# Altium schematic sheet XTIDA-010086_Control_Card_exTrip.SchDoc
size A3; SheetNumber: 1; SheetTotal: 1
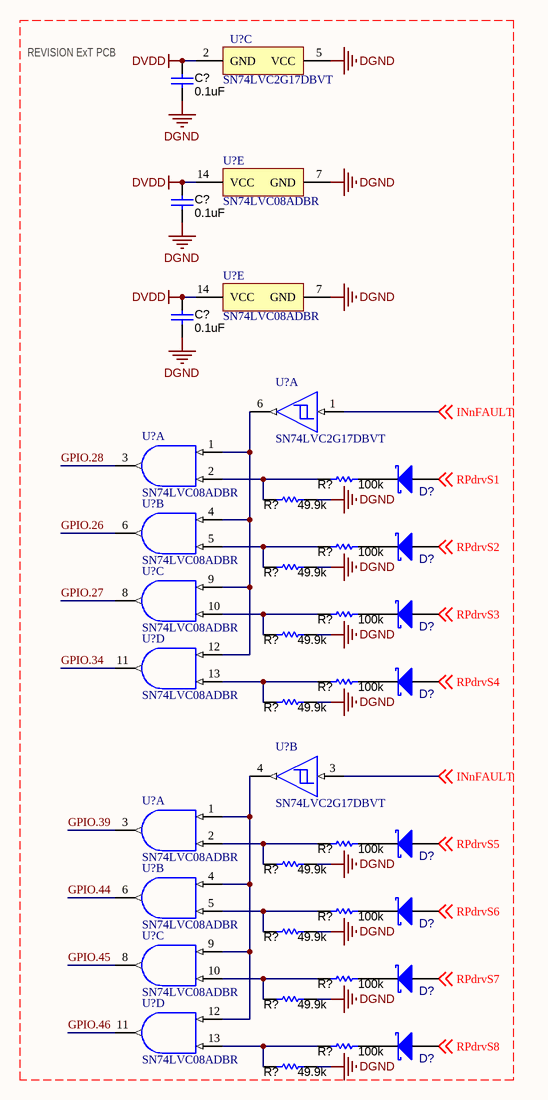
[diagram p0: XTIDA-010086_Control_Card_exTrip.SchDoc]

## Parts
(Parts that share a designator on the sheet are numbered #1, #2 ... from top to bottom, then left to right.)
C?#1  ValueDisplayed: 0.1uF  [0603]  (hidden comment: 06033C104JAT2A)
C?#2  ValueDisplayed: 0.1uF  [0603]  (hidden comment: 06033C104JAT2A)
C?#3  ValueDisplayed: 0.1uF  [0603]  (hidden comment: 06033C104JAT2A)
D?#1  NSR0240V2T1G  [SOD-523]  (value not drawn)
D?#2  NSR0240V2T1G  [SOD-523]  (value not drawn)
D?#3  NSR0240V2T1G  [SOD-523]  (value not drawn)
D?#4  NSR0240V2T1G  [SOD-523]  (value not drawn)
D?#5  NSR0240V2T1G  [SOD-523]  (value not drawn)
D?#6  NSR0240V2T1G  [SOD-523]  (value not drawn)
D?#7  NSR0240V2T1G  [SOD-523]  (value not drawn)
D?#8  NSR0240V2T1G  [SOD-523]  (value not drawn)
R?#1  ValueDisplayed: 100k  [0603]  (hidden comment: RT0603BRD07100KL)
R?#2  ValueDisplayed: 49.9k  [0603]  (hidden comment: CRCW060349K9FKEA)
R?#3  ValueDisplayed: 100k  [0603]  (hidden comment: RT0603BRD07100KL)
R?#4  ValueDisplayed: 49.9k  [0603]  (hidden comment: CRCW060349K9FKEA)
R?#5  ValueDisplayed: 100k  [0603]  (hidden comment: RT0603BRD07100KL)
R?#6  ValueDisplayed: 49.9k  [0603]  (hidden comment: CRCW060349K9FKEA)
R?#7  ValueDisplayed: 100k  [0603]  (hidden comment: RT0603BRD07100KL)
R?#8  ValueDisplayed: 49.9k  [0603]  (hidden comment: CRCW060349K9FKEA)
R?#9  ValueDisplayed: 100k  [0603]  (hidden comment: RT0603BRD07100KL)
R?#10  ValueDisplayed: 49.9k  [0603]  (hidden comment: CRCW060349K9FKEA)
R?#11  ValueDisplayed: 100k  [0603]  (hidden comment: RT0603BRD07100KL)
R?#12  ValueDisplayed: 49.9k  [0603]  (hidden comment: CRCW060349K9FKEA)
R?#13  ValueDisplayed: 100k  [0603]  (hidden comment: RT0603BRD07100KL)
R?#14  ValueDisplayed: 49.9k  [0603]  (hidden comment: CRCW060349K9FKEA)
R?#15  ValueDisplayed: 100k  [0603]  (hidden comment: RT0603BRD07100KL)
R?#16  ValueDisplayed: 49.9k  [0603]  (hidden comment: CRCW060349K9FKEA)
U?#1  SN74LVC2G17DBVT  [DBV0006A_N]  (part C of 3)
U?#2  SN74LVC08ADBR  [DB0014A_M]  (part E of 5)
U?#3  SN74LVC08ADBR  [DB0014A_M]  (part E of 5)
U?#4  SN74LVC2G17DBVT  [DBV0006A_N]  (part A of 3)
U?#5  SN74LVC08ADBR  [DB0014A_M]  (part A of 5)
U?#6  SN74LVC08ADBR  [DB0014A_M]  (part B of 5)
U?#7  SN74LVC08ADBR  [DB0014A_M]  (part C of 5)
U?#8  SN74LVC08ADBR  [DB0014A_M]  (part D of 5)
U?#9  SN74LVC2G17DBVT  [DBV0006A_N]  (part B of 3)
U?#10  SN74LVC08ADBR  [DB0014A_M]  (part A of 5)
U?#11  SN74LVC08ADBR  [DB0014A_M]  (part B of 5)
U?#12  SN74LVC08ADBR  [DB0014A_M]  (part C of 5)
U?#13  SN74LVC08ADBR  [DB0014A_M]  (part D of 5)

## Nets
DGND: C?#1.2 C?#2.2 C?#3.2 R?#2.1 R?#4.1 R?#6.1 R?#8.1 R?#10.1 R?#12.1 R?#14.1 R?#16.1 U?#1.5(VCC) U?#2.7(GND) U?#3.7(GND)
DVDD: C?#1.1 C?#2.1 C?#3.1 U?#1.2(GND) U?#2.14(VCC) U?#3.14(VCC)
GPIO.26: U?#6.6(2Y)
GPIO.27: U?#7.8(3Y)
GPIO.28: U?#5.3(1Y)
GPIO.34: U?#8.11(4Y)
GPIO.39: U?#10.3(1Y)
GPIO.44: U?#11.6(2Y)
GPIO.45: U?#12.8(3Y)
GPIO.46: U?#13.11(4Y)
INnFAULT: U?#4.1(1A) U?#9.3(2A) ; off-sheet INnFAULT
RPdrvS1: D?#1.2(A) ; off-sheet RPdrvS1
RPdrvS2: D?#2.2(A) ; off-sheet RPdrvS2
RPdrvS3: D?#3.2(A) ; off-sheet RPdrvS3
RPdrvS4: D?#4.2(A) ; off-sheet RPdrvS4
RPdrvS5: D?#5.2(A) ; off-sheet RPdrvS5
RPdrvS6: D?#6.2(A) ; off-sheet RPdrvS6
RPdrvS7: D?#7.2(A) ; off-sheet RPdrvS7
RPdrvS8: D?#8.2(A) ; off-sheet RPdrvS8
NetD?#1_1: D?#1.1(K) R?#1.2
NetD?#2_1: D?#2.1(K) R?#3.2
NetD?#3_1: D?#3.1(K) R?#5.2
NetD?#4_1: D?#4.1(K) R?#7.2
NetD?#5_1: D?#5.1(K) R?#9.2
NetD?#6_1: D?#6.1(K) R?#11.2
NetD?#7_1: D?#7.1(K) R?#13.2
NetD?#8_1: D?#8.1(K) R?#15.2
NetR?#1_1: R?#1.1 R?#2.2 U?#5.2(1B)
NetR?#3_1: R?#3.1 R?#4.2 U?#6.5(2B)
NetR?#5_1: R?#5.1 R?#6.2 U?#7.10(3B)
NetR?#7_1: R?#7.1 R?#8.2 U?#8.13(4B)
NetR?#9_1: R?#9.1 R?#10.2 U?#10.2(1B)
NetR?#11_1: R?#11.1 R?#12.2 U?#11.5(2B)
NetR?#13_1: R?#13.1 R?#14.2 U?#12.10(3B)
NetR?#15_1: R?#15.1 R?#16.2 U?#13.13(4B)
NetU?#4_6: U?#4.6(1Y) U?#5.1(1A) U?#6.4(2A) U?#7.9(3A) U?#8.12(4A)
NetU?#9_4: U?#9.4(2Y) U?#10.1(1A) U?#11.4(2A) U?#12.9(3A) U?#13.12(4A)

## Notes on the sheet
- REVISION ExT PCB

## Library data of the parts
C?#1-C?#3 = Capacitor: CAP, CERM, 0.1 uF, 25 V, +/- 5%, X7R, 0603; Manufacturer: AVX; Polarized: N; Value: 0.1uF; U/M: EA; Cap_F: 100nF; ESR_ohm: 0.05; Value1: 0.05 ohm; VDC_V: 25V; TaMin_C: -55°C; TaMax_C: 125°C; AEC Category: Q200; SizeArea_mm2: 1.28; SizeAreaWB_mm2: 4.68; SizeX_mm: 1.6; SizeY_mm: 0.8; SizeZ_mm: 1; CompType: Capacitor; PartNumber: 06033C104JAT2A; PackageReference: 0603; RoHS: Y; Tolerance_%: 5%; Value2: 25V; MountType: SMT; Technology: Ceramic; TempCo: X7R; Cap_Case: 0603; Published: 2008-06-19; Publisher: Texas Instruments; LatestRevisionDate: 2017-03-09; ComponentLink1Description: Datasheet link; ComponentLink1URL: http://datasheets.avx.com/X7RDielectric.pdf; Supplier 1: Digi-Key; Supplier Part Number 1: 478-3713-1-ND; Supplier 2: Mouser; Supplier Part Number 2: 581-06033C104JAT2A; Supplier 3: Farnell; Supplier Part Number 3: 1740614; AEC Qualified: N; AEC Grade: N/A
D?#1-D?#8 = NSR0240V2T1G: Diode, Schottky, 40V, 0.25A, SOD-523; Manufacturer: ON Semiconductor; U/M: EA; Vf_V: 0.7; Value2: 0.7V; Io_A: 0.25; Vr_V: 40; TJmax_C: 150; RJC_CperW: 600; CompType: Diode; SymbolVersion: 2008-12-08; PartNumber: NSR0240V2T1G; PackageReference: SOD-523; Value: 40V; Value1: 0.25A; MountType: SMT; Type: Schottky; RoHS: Y; Published: 2008-06-26; Publisher: Texas Instruments; LatestRevisionDate: 2014-07-21; ComponentLink1Description: Datasheet link; ComponentLink1URL: http://www.onsemi.com/pub_link/Collateral/NSR0240V2T1-D.PDF; Supplier 1: Digi-Key; Supplier Part Number 1: NSR0240V2T1GOSCT-ND; Supplier 2: Mouser; Supplier Part Number 2: 863-NSR0240V2T1G; Supplier 3: Newark; Supplier Part Number 3: 46P8323
R?#1 R?#3 R?#5 R?#7 R?#9 R?#11 R?#13 R?#15 = Resistor: RES, 100 k, 0.1%, 0.1 W, 0603; Manufacturer: Yageo America; Power_W: 100mW; TempCo: 25 ppm/C; U/M: EA; Value: 100k; EIA_Code: E192; SizeX_mm: 1.6; SizeY_mm: 0.8; SizeZ_mm: 1; Value2: 0.1W; SizeArea_mm2: 1.28; VDC_V: 75V; AEC Category: Q200; Publisher: Texas Instruments; Published: 2008-06-26; Value_Code: 100k; RoHS: Y; Value1: 0.1%; MountType: SMT; Supplier 1: Mouser; PackageReference: 0603; Tolerance_%: 0.1%; Res_ohm: 100k; CompType: Resistor; LatestRevisionDate: 2017-03-09; PartNumber: RT0603BRD07100KL; AEC Qualified: ?; ComponentLink1Description: Datasheet link; Supplier Part Number 1: 603-RT0603BRD07100KL; Technology: Thin Film; ComponentLink1URL: http://www.yageo.com/pdf/PYu-RT_1-to-0.05_RoHS_L_3.pdf
R?#2 R?#4 R?#6 R?#8 R?#10 R?#12 R?#14 R?#16 = CRCW060349K9FKEA: RES, 49.9 k, 1%, 0.1 W, 0603; Manufacturer: Vishay-Dale; CompType: Resistor; Value: 49.9k; Res_ohm: 49900; Value_Code: 49k9; Tolerance_%: 1; Power_W: 0.1; Value2: 0.1W; VDC_V: 75; TempCo: 100 ppm/C; SizeArea_mm2: 1.28; SizeX_mm: 1.6; SizeY_mm: 0.8; EIA_Code: E96; U/M: EA; AEC Category: Q200; Green_Lifecycle: Active; Green_REACh: Passed; SymbolVersion: 2009-05-29; PartNumber: CRCW060349K9FKEA; PackageReference: 0603; RoHS: Y; Value1: 1%; MountType: SMT; Technology: Thick Film; SizeZ_mm: 1; Published: 2008-06-26; Publisher: Texas Instruments; LatestRevisionDate: 2017-06-13; ComponentLink1Description: Datasheet link; ComponentLink1URL: http://www.vishay.com/docs/20035/dcrcwe3.pdf; Supplier 1: Digi-Key; Supplier Part Number 1: 541-49.9KHCT-ND; Supplier 2: Mouser; Supplier Part Number 2: 71-CRCW0603-49.9K-E3; Supplier 3: Farnell; Supplier Part Number 3: 1652882; AEC Qualified: ?; Green_EU RoHS: Passed with Exemption; Green_EU RoHS-2: Passed
U?#1 U?#4 U?#9 = TI-SN74XXX2GXXX-6_A-SCHMITT: Dual Schmitt-Trigger Buffer, DBV0006A, SMALL T&R; Manufacturer: Texas Instruments; Output Type: CMOS; Logic: True; Input Type: CMOS/TTL; F @ Nom Voltage(Max)(Mhz): 150; Rating: Catalog; Sub-Family: Non-Inverting Buffer/Driver; Output Drive (IOL/IOH)(Max)(mA): 32/-32; VCC(Min)(V): 1.65; Schmitt Trigger: Yes; tpd @ Nom Voltage(Max)(ns): 9.3,5.7,5.4,4.3; Technology Family: LVC; Voltage(Nom)(V): 1.8,2.5,3.3,5; VCC(Max)(V): 5.5; ICC @ Nom Voltage(Max)(mA): 0.01; 3-State Output: No; Bits(#): 2; Generic Part Number: SN74LVC2G17; Operating Temperature Range(C): -40 to 125,-40 to 85; PackageReference: DBV0006A; DatasheetVersion: SCES381N; PartNumber: SN74LVC2G17DBVT
U?#2 U?#3 U?#5-U?#8 U?#10-U?#13 = CMP-0777-00129-3: Quadruple 2-Input Positive-AND Gate, DB0014A, LARGE T&R; Manufacturer: Texas Instruments; Schmitt Trigger: No; Output Drive (IOL/IOH)(Max)(mA): -24/24; Bits(#): 4; Output Type: TTL; VCC(Max)(V): 3.6; Voltage(Nom)(V): 1.8,2.5,2.7,3.3; Rating: Catalog; ICC @ Nom Voltage(Max)(mA): 0.01; Technology Family: LVC; VCC(Min)(V): 1.65; F @ Nom Voltage(Max)(Mhz): 70; tpd @ Nom Voltage(Max)(ns): 9.8,6.9,4.8,4.1; PackageReference: DB0014A; DatasheetVersion: SCAS283Q; Generic Part Number: SN74LVC08A; Input Type: TTL; Operating Temperature Range(C): -40 to 125